# EAGLE design AtmegaRFM69_through_hole (EAGLE 6.5.0)
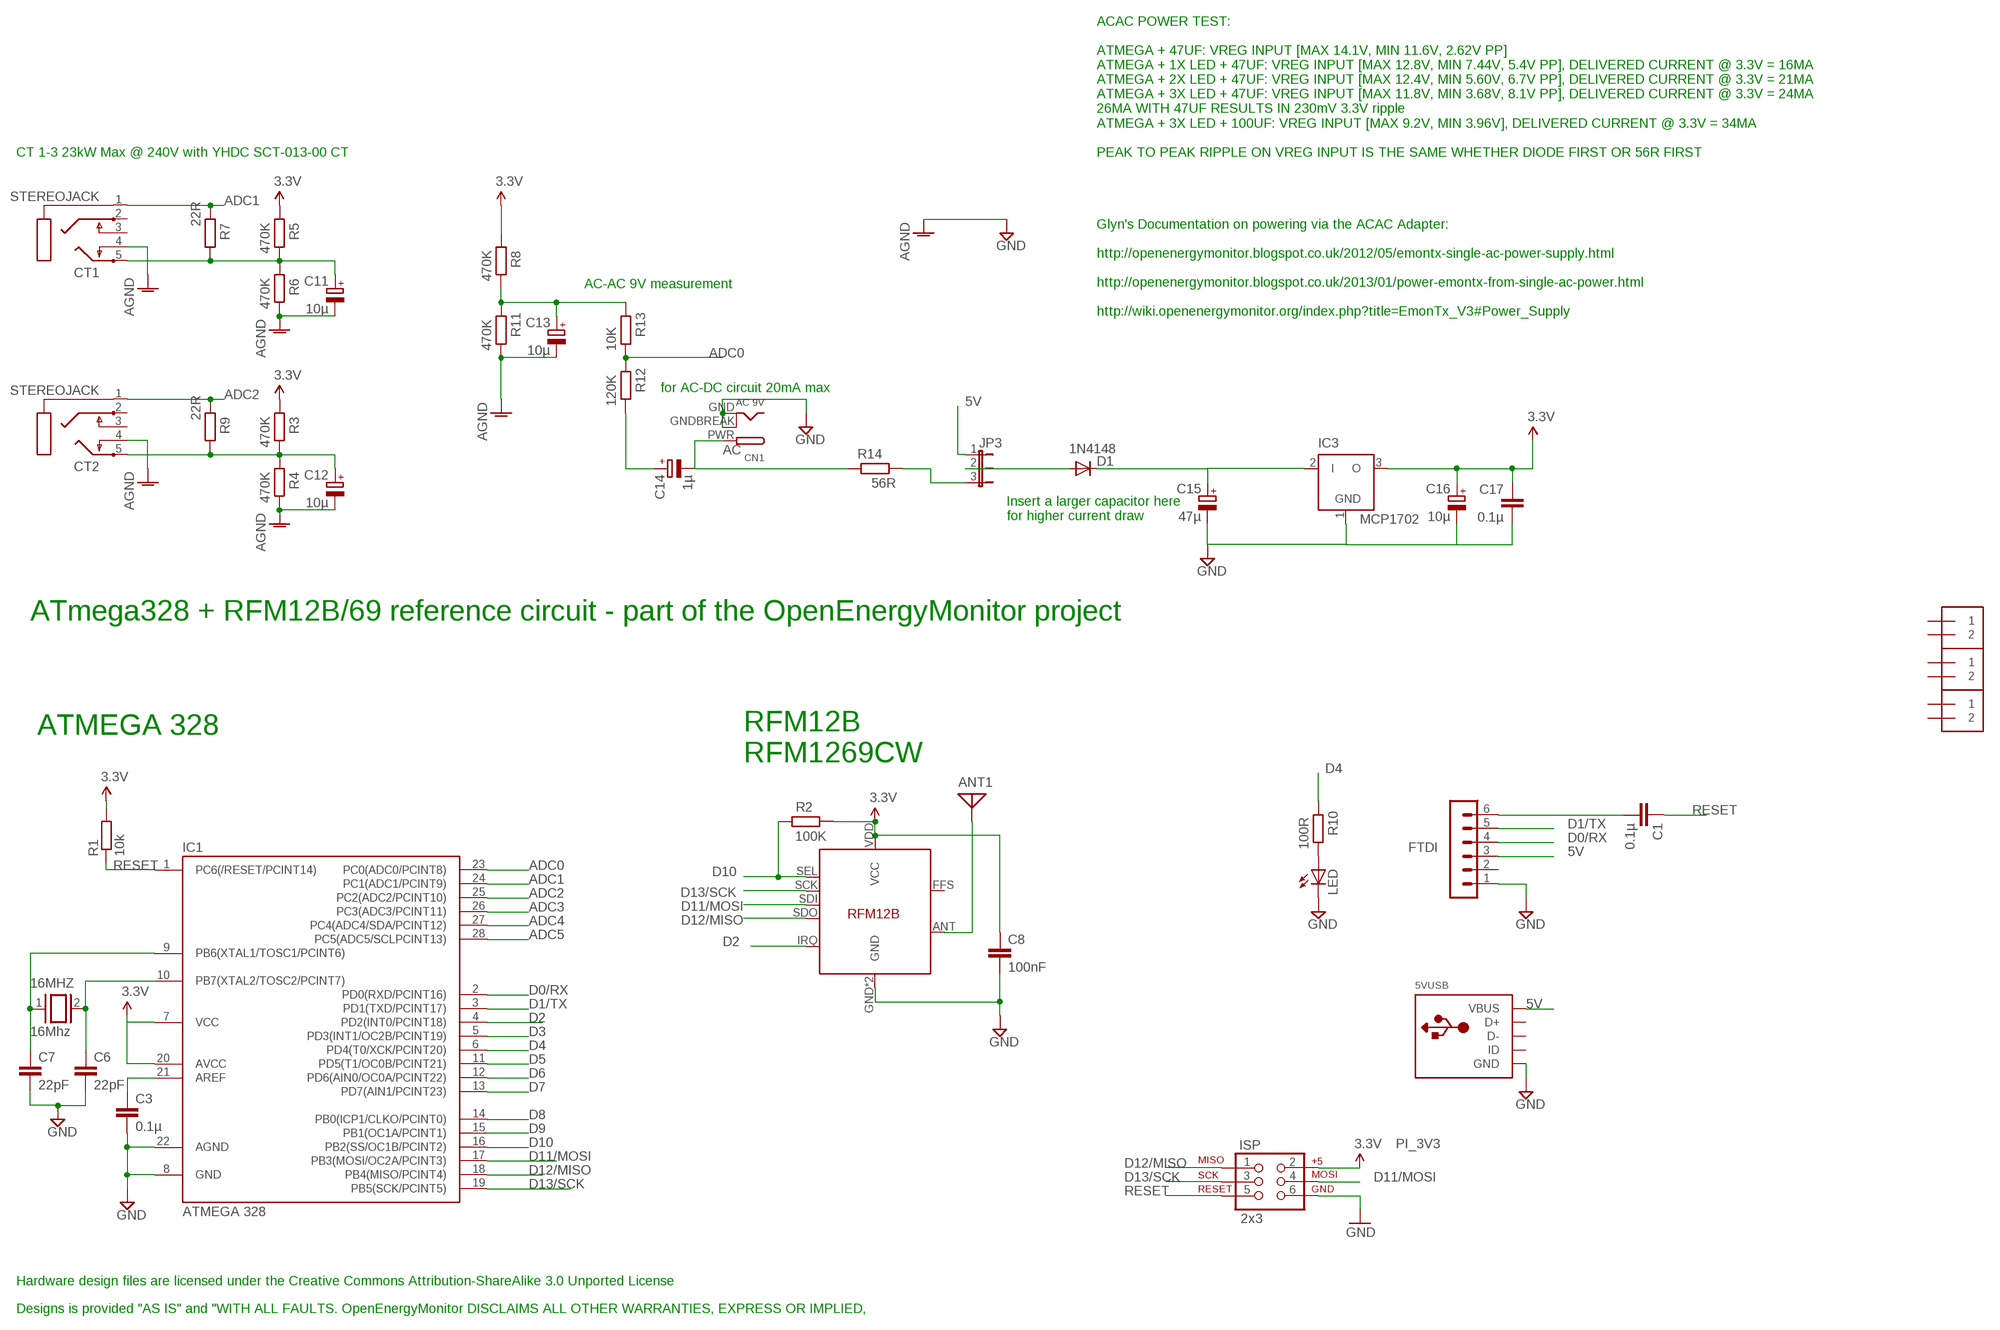
[diagram p0: schematic, sheet 1]

## Parts
5VUSB  USBMOLEX  [USB-MINIB-THM-MOLEX]
16MHZ  16Mhz  XTAL/S  [QS]
ANT1  ANTENNA  [PAD-01]
C1  0.1µ  C-EU025-024X044  [C025-024X044]
C3  0.1µ  C-EU025-024X044  [C025-024X044]
C6  22pF  C2.5/2  [C2.5-2]
C7  22pF  C2.5/2  [C2.5-2]
C8  100nF  C-EU025-024X044  [C025-024X044]
C11  10µ  CPOL-EUE1.8-4  [E1,8-4]
C12  10µ  CPOL-EUE1.8-4  [E1,8-4]
C13  10µ  CPOL-EUE1.8-4  [E1,8-4]
C14  1µ  CPOL-EUE1.8-4  [E1,8-4]
C15  47µ  CPOL-EUE1.8-4  [E1,8-4]
C16  10µ  CPOL-EUE1.8-4  [E1,8-4]
C17  0.1µ  C-EU025-024X044  [C025-024X044]
CN1  AC 9V  DCBARRELPTH  [DCJACK_2MM_PTH]
CT1  STEREOJACK  [STX3100]
CT2  STEREOJACK  [STX3100]
D1  1N4148  DIODE1N4148  [DIODE-1N4148]
FTDI  FTDI  MA06-1  [MA06-1]
IC1  ATMEGA 328  ATMEGA48/88/168-PU  [DIL28-3]
IC3  MCP1702  MCP1702Z  [TO92]
ISP  2x3  AVR_SPI_PRG_6PTH  [2X3]
J1  1X2-3.5MM  [1X2-3.5MM]
J2  1X2-3.5MM  [1X2-3.5MM]
J3  1X2-3.5MM  [1X2-3.5MM]
JP3  JP2E  [JP2]
LED  LED3MM  [LED3MM]
R1  10k  R-EU_0204/7  [0204/7]
R2  100K  R-EU_0204/7  [0204/7]
R3  470K  R-EU_0204/7  [0204/7]
R4  470K  R-EU_0204/7  [0204/7]
R5  470K  R-EU_0204/7  [0204/7]
R6  470K  R-EU_0204/7  [0204/7]
R7  22R  R-EU_0204/7  [0204/7]
R8  470K  R-EU_0204/7  [0204/7]
R9  22R  R-EU_0204/7  [0204/7]
R10  100R  R-EU_0204/7  [0204/7]
R11  470K  R-EU_0204/7  [0204/7]
R12  120K  R-EU_0204/7  [0204/7]
R13  10K  R-EU_0204/7  [0204/7]
R14  56R  R-EU_0204/7  [0204/7]
U$14  RFM12B  [RFM12B]

## Nets
3.3V: C8.1 C16.+ C17.1 IC1.7(VCC) IC1.20(AVCC) IC3.3(O) ISP.2 R1.2 R2.1 R3.2 R5.2 R8.2 U$14.VDD(VCC)
5V [power]: 5VUSB.VBUS FTDI.3 JP3.1
AC: C14.- CN1.PWR R14.2
ADC0: IC1.23(PC0(ADC0/PCINT8)) R12.2 R13.1
ADC1: CT1.1 IC1.24(PC1(ADC1/PCINT9)) R7.2
ADC2: CT2.1 IC1.25(PC2(ADC2/PCINT10)) R9.2
ADC3: IC1.26(PC3(ADC3/PCINT11))
ADC4: IC1.27(PC4(ADC4/SDA/PCINT12))
ADC5: IC1.28(PC5(ADC5/SCLPCINT13))
AGND [gnd]: C11.- C12.- C13.- CT1.4 CT2.4 R4.1 R6.1 R11.1 ; supply symbol labelled GND
D0/RX: FTDI.4 IC1.2(PD0(RXD/PCINT16))
D1/TX: FTDI.5 IC1.3(PD1(TXD/PCINT17))
D2: IC1.4(PD2(INT0/PCINT18)) U$14.IRQ
D3: IC1.5(PD3(INT1/OC2B/PCINT19))
D4: IC1.6(PD4(T0/XCK/PCINT20)) R10.2
D5: IC1.11(PD5(T1/OC0B/PCINT21))
D6: IC1.12(PD6(AIN0/OC0A/PCINT22))
D7: IC1.13(PD7(AIN1/PCINT23))
D8: IC1.14(PB0(ICP1/CLKO/PCINT0))
D9: IC1.15(PB1(OC1A/PCINT1))
D10: IC1.16(PB2(SS/OC1B/PCINT2)) R2.2 U$14.SEL
D11/MOSI: IC1.17(PB3(MOSI/OC2A/PCINT3)) ISP.4 U$14.SDI
D12/MISO: IC1.18(PB4(MISO/PCINT4)) ISP.1 U$14.SDO
D13/SCK: IC1.19(PB5(SCK/PCINT5)) ISP.3 U$14.SCK
DIG1: ANT1.1 U$14.ANT
GND [power]: 5VUSB.GND C3.2 C6.2 C7.2 C8.2 C15.- C16.- C17.2 CN1.GND CN1.GNDBREAK FTDI.1 IC1.8(GND) IC1.22(AGND) IC3.1(GND) ISP.6 LED.K(C) U$14.GND U$14.P$12(GND)
N$1: 16MHZ.2 C6.1 IC1.10(PB7(XTAL2/TOSC2/PCINT7))
N$2: C12.+ CT2.5 R3.1 R4.2 R9.1
N$3: JP3.3 R14.1
N$4: C15.+ D1.C IC3.2(I)
N$5: D1.A JP3.2
N$7: C14.+ R12.1
N$8: LED.A R10.1
N$12: 16MHZ.1 C7.1 IC1.9(PB6(XTAL1/TOSC1/PCINT6))
N$15: C1.2 FTDI.6
N$19: C3.1 IC1.21(AREF)
N$34: C13.+ R8.1 R11.2 R13.2
N$38: C11.+ CT1.5 R5.1 R6.2 R7.1
RESET: C1.1 IC1.1(PC6(/RESET/PCINT14)) ISP.5 R1.1
Unconnected: 5VUSB.D+ 5VUSB.D- 5VUSB.ID CT1.2 CT1.3 CT2.2 CT2.3 FTDI.2 J1.1 J1.2 J2.1 J2.2 J3.1 J3.2 U$14.FFS

## Notes on the sheet
- CT 1-3 23kW Max @ 240V with YHDC SCT-013-00 CT
- ACAC POWER TEST:
  
  ATMEGA + 47UF: VREG INPUT [MAX 14.1V, MIN 11.6V, 2.62V PP]
  ATMEGA + 1X LED + 47UF: VREG INPUT [MAX 12.8V, MIN 7.44V, 5.4V PP], DELIVERED CURRENT @ 3.3V = 16MA
  ATMEGA + 2X LED + 47UF: VREG INPUT [MAX 12.4V, MIN 5.60V, 6.7V PP], DELIVERED CURRENT @ 3.3V = 21MA
  ATMEGA + 3X LED + 47UF: VREG INPUT [MAX 11.8V, MIN 3.68V, 8.1V PP], DELIVERED CURRENT @ 3.3V = 24MA
  26MA WITH 47UF RESULTS IN 230mV 3.3V ripple
  ATMEGA + 3X LED + 100UF: VREG INPUT [MAX 9.2V, MIN 3.96V], DELIVERED CURRENT @ 3.3V = 34MA
  
  PEAK TO PEAK RIPPLE ON VREG INPUT IS THE SAME WHETHER DIODE FIRST OR 56R FIRST
- AC-AC 9V measurement
- Glyn's Documentation on powering via the ACAC Adapter:
  
  http://openenergymonitor.blogspot.co.uk/2012/05/emontx-single-ac-power-supply.html
  
  http://openenergymonitor.blogspot.co.uk/2013/01/power-emontx-from-single-ac-power.html
  
  http://wiki.openenergymonitor.org/index.php?title=EmonTx_V3#Power_Supply
- for AC-DC circuit 20mA max
- Insert a larger capacitor here
  for higher current draw
- ATmega328 + RFM12B/69 reference circuit - part of the OpenEnergyMonitor project
- ATMEGA 328
- RFM12B
  RFM1269CW
- Hardware design files are licensed under the Creative Commons Attribution-ShareAlike 3.0 Unported License
- Designs is provided "AS IS" and "WITH ALL FAULTS. OpenEnergyMonitor DISCLAIMS ALL OTHER WARRANTIES, EXPRESS OR IMPLIED,

## Library data of the parts
5VUSB = adafruit:USB: USB Connectors USBMINIB - Surface Mount Female Mini-B USB Connector 4UConnector: 06564 By microbuilder.eu Thru-hole RA Female Mini-B USB Connector 4UConnector: 18732 By ladyada.net
16MHZ = special:XTAL/S: CRYSTAL
ANT1 = discrete:ANTENNA: Antenna
C1 C3 C8 C17 = resistor:C-EU: CAPACITOR, European symbol
C6 C7 = capacitor-wima:C: CAPACITOR naming: grid - package width
C11-C16 = resistor:CPOL-EU: POLARIZED CAPACITOR, European symbol
CN1 = adafruit:DCBARREL: 2.0mm DC Barrel Jack DCJACK_2MM_PTH - Through Hole Jack (4UConnector: 05537)
CT1 CT2 = adafruit:STEREOJACK: MIC/HEADPHONE JACK Stereo jack with two switches. Kycon STX3100, CUI SJ1-3555NG and/or 4UCon 05544
D1 = SparkFun:DIODE: Diode These are standard reverse protection diodes and small signal diodes. SMA package can handle up to about 1A. SOD-323 can handle about 200mA. What the SOD-323 package when ordering, there are some mfgs out there that are 5-pin packages.
FTDI = JeeLabs:MA06-1: PIN HEADER
IC1 = atmega8:ATMEGA48/88/168-PU
IC3 = JeeLabs:MCP1702: 200 mA, Low Power Low Dropout Voltage Regulator
ISP = SparkFun:AVR_SPI_PRG_6: AVR ISP 6 Pin This is the reduced ISP connector for AVR programming. Common on Arduino. This footprint will take up less PCB space and can be used with a 10-pin to 6-pin adapter such as SKU: BOB-08508
J1-J3 = adafruit:1X2: 3.5mm Terminal block http://www.ladyada.net/library/pcb/eaglelibrary.html
JP3 = jumper:JP2E: JUMPER
LED = adafruit:LED: LED OSRAM: - CHIPLED LG R971, LG N971, LY N971, LG Q971, LY Q971, LO R971, LY R971 LH N974, LH R974 LS Q976, LO Q976, LY Q976 LO Q996 - Hyper CHIPLED LW Q18S LB Q993, LB Q99A, LB R99A - SideLED LS A670, LO A670, LY A670, LG A670, LP A670 LB A673, LV A673, LT A673, LW A673 LH A674 LY A675 LS A676, LA A676, LO A676, LY A676, LW A676 LS A679, LY A679, LG A679 - Hyper Micro SIDELED® LS Y876, LA Y876, LO Y876, LY Y876 LT Y87S - SmartLED LW L88C, LW L88S LB L89C, LB L89S, LG L890 LS L89K, LO L89K, LY L89K LS L896, LA L896, LO L896, LY L896 - TOPLED LS T670, LO T670, LY T670, LG T670, LP T670 LSG T670, LSP T670, LSY T670, LOP T670, LYG T670 LG T671, LOG T671, LSG T671 LB T673, LV T673, LT T673, LW T673 LH T674 LS T676, LA T676, LO T676, LY T676, LB T676, LH T676, LSB T676, LW T676 LB T67C, LV T67C, LT T67C, LS T67K, LO T67K, LY T67K, LW E67C LS E67B, LA E67B, LO E67B, LY E67B, LB E67C, LV E67C, LT E67C LW T67C LS T679, LY T679, LG T679 LS T770, LO T770, LY T770, LG T770, LP T770 LB T773, LV T773, LT T773, LW T773 LH T774 LS E675, LA E675, LY E675, LS T675 LS T776, LA T776, LO T776, LY T776, LB T776 LHGB T686 LT T68C, LB T68C - Hyper Mini TOPLED® LB M676 - Mini TOPLED Santana® LG M470 LS M47K, LO M47K, LY M47K Source: http://www.osram.convergy.de/
R1 = resistor:R-EU_: RESISTOR, European symbol
R2-R14 = rcl:R-EU_: RESISTOR, European symbol
U$14 = JeeParts:RFM12B

## Net classes
0 default: width 0.203 mm, drill 0.6 mm, clearance 0.203 mm
1 power: width 0.381 mm, drill 0.6 mm, clearance 0.254 mm
2 gnd: width 0.254 mm, drill 0.6 mm, clearance 0.254 mm

## Board
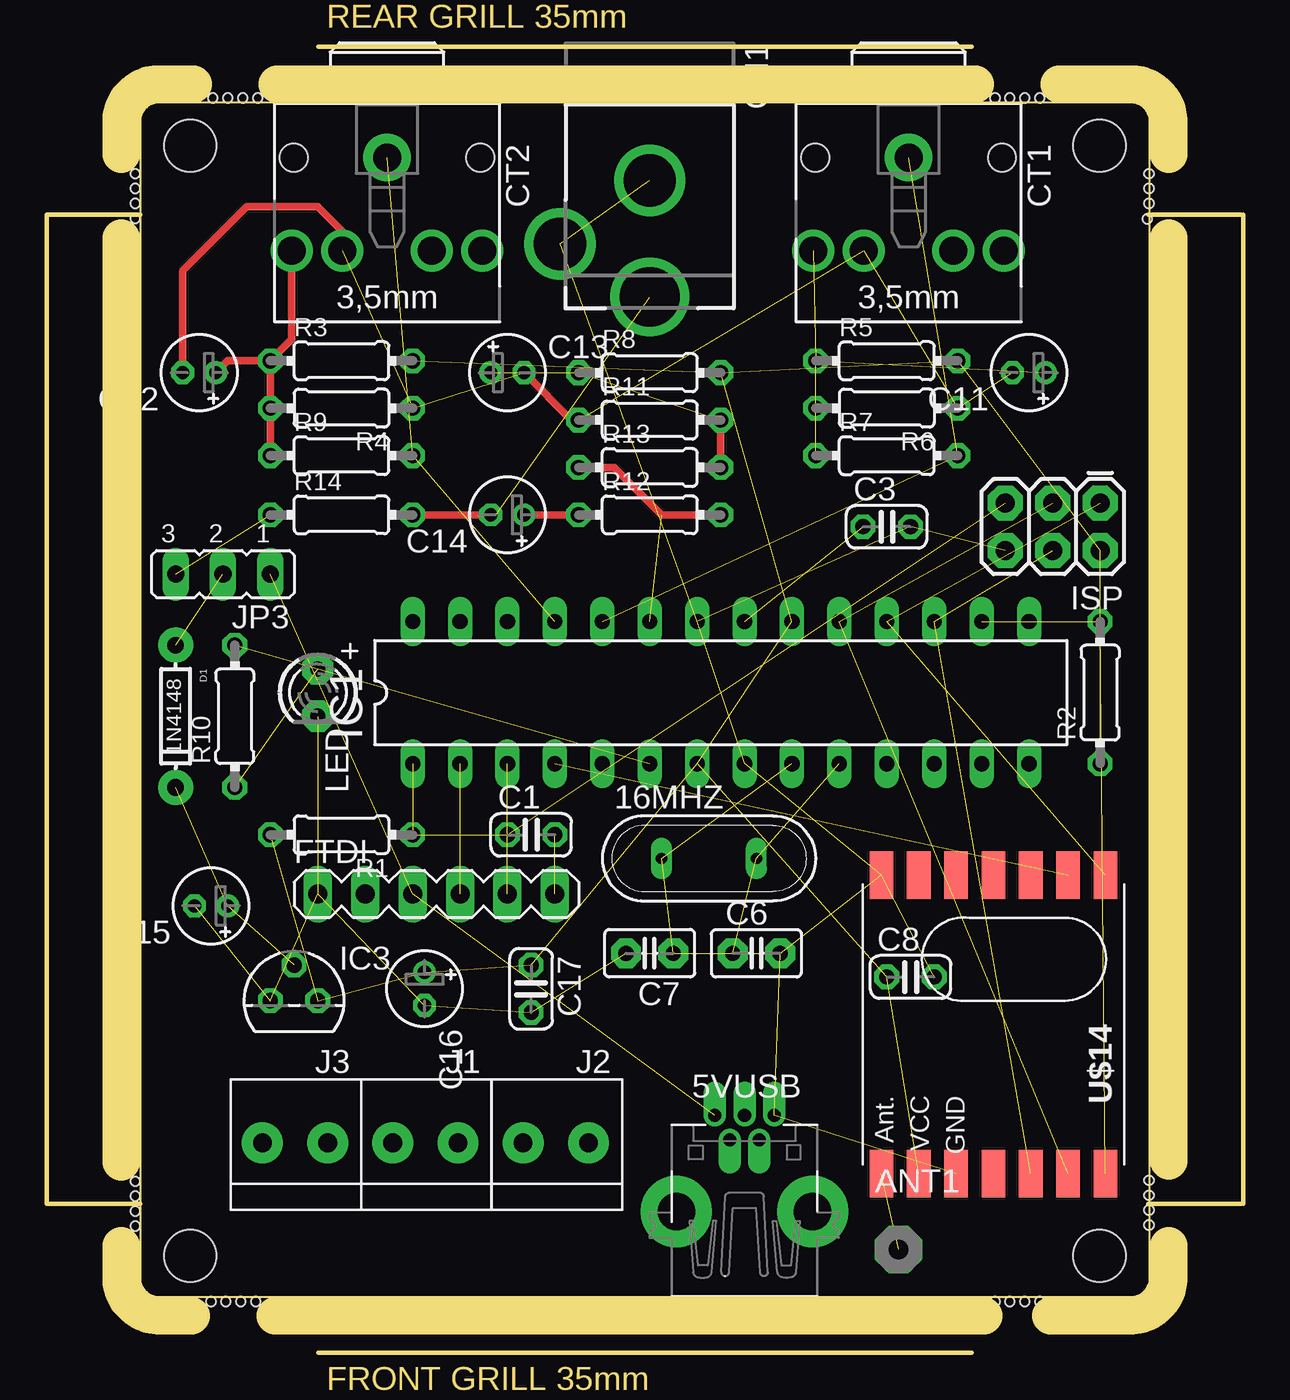
[diagram p1: board, top side]

Size 64.1 x 70 mm. Coordinates in mm from the lower left corner, seen from the top.
Outline: 5,61 5,66 arc-90 6,67 58.1,67 arc-90 59.1,66 59.1,4 arc-90 58.1,3 6,3 arc-90 5,4 5,8
Outline: 5,61 5,8
Outline: 14.55,0 49.55,0
Outline: 14.55,70 49.55,70
Outline: 64.1,61 64.1,8
Outline: 5,61 0,61 0,8 5,8
Outline: 64,8 59,8
Outline: 64,61 59,61
Copper layers (1*16): Top 0.035mm / dielectric 1.5mm / Bottom 0.035mm
Design rules "default": minimum track width 10mil, minimum drill 24mil, track to track 8mil, track to pad 8mil, pad to pad 8mil, via to via 8mil, smd to smd 8mil, copper to edge 40mil, drill to drill 8mil, minimum pad ring 10mil, minimum via ring 8mil, stop-mask expansion 4mil, vias tented up to drill 0mil, thermal gap 10mil
Holes 2.8 mm at 7.7,5.2 7.7,64.7 56.4,64.7 56.4,5.2
Holes 0.5 mm at 8.9,67.25 9.7,67.25 10.5,67.25 11.3,67.25 50.8,67.25 51.6,67.25 53.2,67.25 52.4,67.25 58.96,60.77 59.05,61.6 59.05,63.2 59.05,62.4 4.75,60.8 4.75,61.6 4.75,63.2 4.75,62.4 50.8,2.75 51.6,2.75 52.4,2.75 53.2,2.75 8.8,2.75 9.6,2.75 10.4,2.75 11.2,2.75 4.75,6.8 4.75,7.6 4.75,8.4 4.75,9.2 59.05,6.85 59.05,7.65 59.05,8.45 59.05,9.25
Milling: 16 lines

### Footprints (pad centres in the part's own frame; a part is rotated, then mirrored left to right if it is on the bottom)
USB-MINIB-THM-MOLEX = drill 0.7 offset: D+ 0,9.72; D- -0.8,8.42; GND 1.6,9.72; ID 0.8,8.42; VBUS -1.6,9.72 | drill 2 pad 3.81: GND1 -3.65,4.57; GND4 3.65,4.57
QS = drill 0.61 long: 1 -2.54,0; 2 2.54,0
PAD-01 = drill 1.321 pad 2.54 octagon: 1 0,0
C025-024X044 = drill 0.813 octagon: 1 -1.27,0; 2 1.27,0
C2.5-2 = drill 0.813 pad 1.6 octagon: 1 -1.27,0; 2 1.27,0
E1,8-4 = drill 0.711 pad 1.168: + -0.889,0 | drill 0.711 pad 1.168 octagon: - 0.889,0
DCJACK_2MM_PTH = drill 2.8: GND 0,7.35; GNDBREAK 4.8,10.75 | drill 3.2: PWR 0,13.6
STX3100 = drill 1.5 pad 2.54: 1 2.7,-0.1 | drill 1.5: 2 7.7,5; 3 7.7,2.3; 4 7.7,-2.5; 5 7.7,-5.2 | hole 1.5: 2.7,4.9; 2.7,-5.1
DIODE-1N4148 = drill 0.9 pad 1.88: A -3.81,0; C 3.81,0
MA06-1 = drill 1.016 long: 1 0,0; 2 2.54,0; 3 5.08,0; 4 7.62,0; 5 10.16,0; 6 12.7,0
DIL28-3 = drill 0.813 long: 1 -16.51,-3.81; 2 -13.97,-3.81; 3 -11.43,-3.81; 4 -8.89,-3.81; 5 -6.35,-3.81; 6 -3.81,-3.81; 7 -1.27,-3.81; 8 1.27,-3.81; 9 3.81,-3.81; 10 6.35,-3.81; 11 8.89,-3.81; 12 11.43,-3.81; 13 13.97,-3.81; 14 16.51,-3.81; 15 16.51,3.81; 16 13.97,3.81; 17 11.43,3.81; 18 8.89,3.81; 19 6.35,3.81; 20 3.81,3.81; 21 1.27,3.81; 22 -1.27,3.81; 23 -3.81,3.81; 24 -6.35,3.81; 25 -8.89,3.81; 26 -11.43,3.81; 27 -13.97,3.81; 28 -16.51,3.81
TO92 = drill 0.813 octagon: 1 -1.27,0; 2 0,1.905; 3 1.27,0
2X3 = drill 1.016 pad 1.88 octagon: 1 0,0; 2 0,2.54; 3 2.54,0; 4 2.54,2.54; 5 5.08,0; 6 5.08,2.54
1X2-3.5MM = drill 1 pad 2.184: 1 1.8,0; 2 -1.7,0
JP2 = drill 0.914 long: 1 -2.54,0; 2 0,0; 3 2.54,0
LED3MM = drill 0.813 pad 1.676 octagon: A -1.27,0; K 1.27,0
0204/7 = drill 0.813 octagon: 1 -3.81,0; 2 3.81,0
RFM12B = smd 2.54 x 1.27: ANT 8,-6; FFS -8,2; GND 8,-2; IRQ -8,4; P$8 -8,0; P$9 -8,-2; P$10 -8,-4; P$12 -8,-6; P$16 8,0; SCK 8,4; SDI 8,2; SDO -8,6; SEL 8,6; VDD 8,-4

### Placement (x,y rotation side)
5VUSB  37.38,3 0 top
16MHZ  35.48,26.49 0 top
ANT1  45.64,5.54 0 top
C1  25.96,27.77 0 top
C3  45.01,44.27 0 top
C6  38.02,21.41 0 top
C7  32.3,21.41 180 top
C8  46.27,20.14 0 top
C11  52.62,52.53 180 top
C12  8.18,52.53 180 top
C13  24.69,52.53 0 top
C14  24.69,44.91 180 top
C15  8.81,23.95 180 top
C16  20.24,19.51 270 top
C17  25.96,19.51 270 top
CN1  32.3,70.18 180 top
CT1  46.27,66.75 270 top
CT2  18.34,66.75 270 top
D1  6.91,34.12 270 top
FTDI  14.53,24.59 0 top
IC1  36.12,35.38 0 top
IC3  13.26,18.88 0 top
ISP  56.44,45.55 180 top
J1  20.24,11.26 0 top
J2  27.23,11.26 0 top
J3  13.26,11.26 0 top
JP3  9.45,41.73 180 top
LED  14.53,35.38 270 top
R1  15.8,27.77 180 top
R2  56.44,35.38 90 top
R3  15.8,53.16 0 top
R4  15.8,50.62 180 top
R5  45.01,53.16 0 top
R6  45.01,50.62 180 top
R7  45.01,48.09 0 top
R8  32.3,52.53 0 top
R9  15.8,48.09 0 top
R10  10.08,34.12 90 top
R11  32.3,49.99 0 top
R12  32.3,44.91 0 top
R13  32.3,47.45 0 top
R14  15.8,44.91 0 top
U$14  50.72,17.61 270 top

### Tracks (layer width: path | path; a pad name or v marks a point on that pad's centre or on a via)
3.3V  (12 unrouted)
5V  (2 unrouted)
AC  (1 unrouted)
  Top 0.406: R14.2 C14.- 24.05,44.91
ADC0  (1 unrouted)
  Top 0.406: R13.1 30.4,47.45 32.94,44.91 R12.2
ADC1  (2 unrouted)
ADC2  (2 unrouted)
AGND  (5 unrouted)
  Top 0.406: R11.1 28.11,49.99 C13.- | C12.- 7.29,57.99 10.71,61.42 14.53,61.42 15.8,60.15 15.8,59.09 CT2.4
D0/RX  (1 unrouted)
D1/TX  (1 unrouted)
D2  (1 unrouted)
D4  (1 unrouted)
D10  (2 unrouted)
D11/MOSI  (2 unrouted)
D12/MISO  (2 unrouted)
D13/SCK  (2 unrouted)
DIG1  (1 unrouted)
GND  (17 unrouted)
N$1  (2 unrouted)
N$2
  Top 0.406: R9.1 R4.2 R3.1 | R3.1 9.7,53.16 C12.+ | CT2.5 13.13,54.31 R3.1
N$3  (1 unrouted)
N$4  (2 unrouted)
N$5  (1 unrouted)
N$7
  Top 0.406: C14.+ R12.1
N$8  (1 unrouted)
N$12  (2 unrouted)
N$15  (1 unrouted)
N$19  (1 unrouted)
N$34  (2 unrouted)
  Top 0.406: R13.2 R11.2
N$38  (4 unrouted)
RESET  (3 unrouted)

### Text on the board
Dimension: REAR GRILL 35mm | FRONT GRILL 35mm